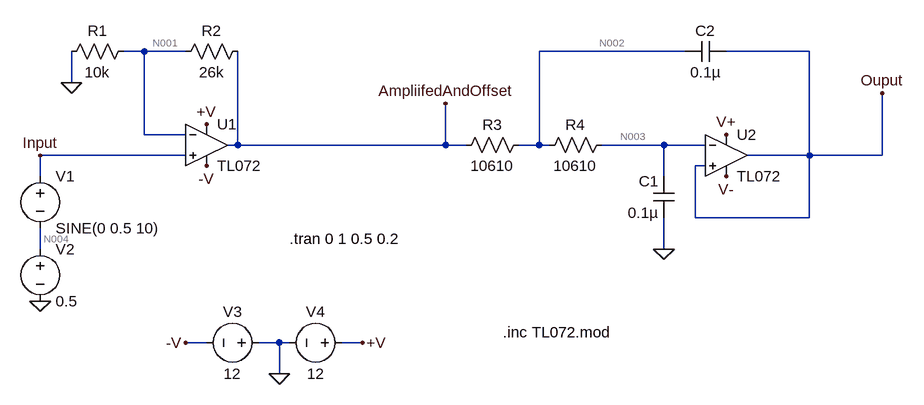
[diagram p0: schematic Signal Conditioning Circuit.asc]
Signal Conditioning Circuit.asc, the LTspice schematic file:
Version 4
SHEET 1 1332 680
WIRE 48 -128 16 -128
WIRE 112 -128 48 -128
WIRE 880 -128 656 -128
WIRE 1072 -128 944 -128
WIRE -64 -80 -64 -128
WIRE 48 0 48 -128
WIRE 112 0 48 0
WIRE 192 16 192 -128
WIRE 192 16 176 16
WIRE 512 16 512 -48
WIRE 512 16 192 16
WIRE 544 16 512 16
WIRE 656 16 656 -128
WIRE 656 16 624 16
WIRE 672 16 656 16
WIRE 848 16 752 16
WIRE 912 16 848 16
WIRE 112 32 -112 32
WIRE 1072 32 1072 -128
WIRE 1072 32 976 32
WIRE 1184 32 1184 -64
WIRE 1184 32 1072 32
WIRE 912 48 896 48
WIRE -112 64 -112 32
WIRE 848 64 848 16
WIRE 896 128 896 48
WIRE 1072 128 1072 32
WIRE 1072 128 896 128
WIRE -112 176 -112 144
WIRE 848 176 848 128
WIRE 144 320 112 320
WIRE 256 320 224 320
WIRE 272 320 256 320
WIRE 384 320 352 320
WIRE 256 368 256 320
FLAG -112 256 0
FLAG -64 -80 0
FLAG -112 32 Input
FLAG 256 368 0
FLAG 112 320 -V
FLAG 384 320 +V
FLAG 144 48 -V
FLAG 144 -16 +V
FLAG 848 176 0
FLAG 512 -48 AmpliifedAndOffset
FLAG 1184 -64 Ouput
FLAG 944 0 V+
FLAG 944 64 V-
SYMBOL voltage -112 48 R0
WINDOW 123 0 0 Left 0
WINDOW 39 0 0 Left 0
SYMATTR InstName V1
SYMATTR Value SINE(0 0.5 10)
SYMBOL Opamps\\opamp2 144 -48 R0
SYMATTR InstName U1
SYMATTR Value TL072
SYMBOL voltage -112 160 R0
WINDOW 123 0 0 Left 0
WINDOW 39 0 0 Left 0
SYMATTR InstName V2
SYMATTR Value 0.5
SYMBOL res 32 -144 R90
WINDOW 0 0 56 VBottom 2
WINDOW 3 32 56 VTop 2
SYMATTR InstName R1
SYMATTR Value 10k
SYMBOL res 208 -144 R90
WINDOW 0 0 56 VBottom 2
WINDOW 3 32 56 VTop 2
SYMATTR InstName R2
SYMATTR Value 26k
SYMBOL voltage 240 320 R90
WINDOW 0 -32 56 VBottom 2
WINDOW 3 32 56 VTop 2
WINDOW 123 0 0 Left 0
WINDOW 39 0 0 Left 0
SYMATTR InstName V3
SYMATTR Value 12
SYMBOL voltage 368 320 R90
WINDOW 0 -32 56 VBottom 2
WINDOW 3 32 56 VTop 2
WINDOW 123 0 0 Left 0
WINDOW 39 0 0 Left 0
SYMATTR InstName V4
SYMATTR Value 12
SYMBOL res 640 0 R90
WINDOW 0 0 56 VBottom 2
WINDOW 3 32 56 VTop 2
SYMATTR InstName R3
SYMATTR Value 10610
SYMBOL res 768 0 R90
WINDOW 0 0 56 VBottom 2
WINDOW 3 32 56 VTop 2
SYMATTR InstName R4
SYMATTR Value 10610
SYMBOL cap 864 128 R180
WINDOW 0 24 56 Left 2
WINDOW 3 24 8 Left 2
SYMATTR InstName C1
SYMATTR Value 0.1µ
SYMBOL cap 880 -112 R270
WINDOW 0 32 32 VTop 2
WINDOW 3 0 32 VBottom 2
SYMATTR InstName C2
SYMATTR Value 0.1µ
SYMBOL Opamps\\opamp2 944 -32 R0
SYMATTR InstName U2
SYMATTR Value TL072
TEXT 272 160 Left 2 !.tran 0 1 0.5 0.2
TEXT 600 304 Left 2 !.inc TL072.mod

The netlist it stands for:
* Signal Conditioning Circuit.asc
V1 Input N004 SINE(0 0.5 10)
XU1 Input N001 +V -V AmpliifedAndOffset TL072  ; pins In+ In- V+ V- OUT
V2 N004 0 0.5
R1 N001 0 10k
R2 AmpliifedAndOffset N001 26k
V3 0 -V 12
V4 +V 0 12
R3 N002 AmpliifedAndOffset 10610
R4 N003 N002 10610
C1 0 N003 0.1µ
C2 N002 Ouput 0.1µ
XU2 Ouput N003 V+ V- Ouput TL072  ; pins In+ In- V+ V- OUT
.tran 0 1 0.5 0.2
.inc TL072.mod
.backanno
.end

* Results of the author's LTspice run, read from the files saved beside the schematic
* Operating Point, zero values left out:
*   V(input) = 500 mV
*   V(n004) = 500 mV
*   V(ampliifedandoffset) = 1.8 V
*   V(-v) = -12 V
*   V(+v) = 12 V
*   V(n001) = 500 mV
*   V(n002) = 2.812 V
*   V(n003) = 3.825 V
*   V(ouput) = 5.205 V
*   V(v-) = 3.735 V
*   V(v+) = 6.673 V
*   I(R4) = 95.43 µA
*   I(R3) = 95.43 µA
*   I(R2) = 50 µA
*   I(R1) = 50 µA
*   I(V4) = -11.39 mA
*   I(V3) = -11.39 mA
*   I(V2) = -42.55 pA
*   I(V1) = -42.55 pA
*   Ix(u1:1) = 42.55 pA
*   Ix(u1:2) = 42.55 pA
*   Ix(u1:3) = 11.39 mA
*   Ix(u1:4) = -11.39 mA
*   Ix(u1:5) = 45.43 µA
*   Ix(u2:1) = 32.44 pA
*   Ix(u2:2) = -95.43 µA
*   Ix(u2:5) = -32.06 pA
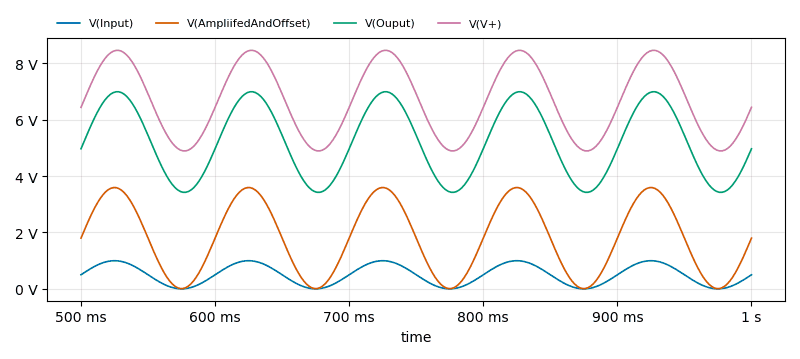
[diagram p1: Transient Analysis of Signal Conditioning Circuit.asc, plotted from the saved traces]
* Transient Analysis, 1 run:
*   V(Input): min 2.837 mV, max 997.2 mV, average 500 mV, rms 611.6 mV, last 500 mV
*   V(AmpliifedAndOffset): min 10.26 mV, max 3.59 V, average 1.8 V, rms 2.202 V, last 1.8 V
*   V(Ouput): min 3.423 V, max 6.987 V, average 5.205 V, rms 5.356 V, last 4.967 V
*   V(V+): min 4.891 V, max 8.455 V, average 6.673 V, rms 6.791 V, last 6.435 V